# EAGLE design TMR1_v2 (EAGLE 9.2.2)
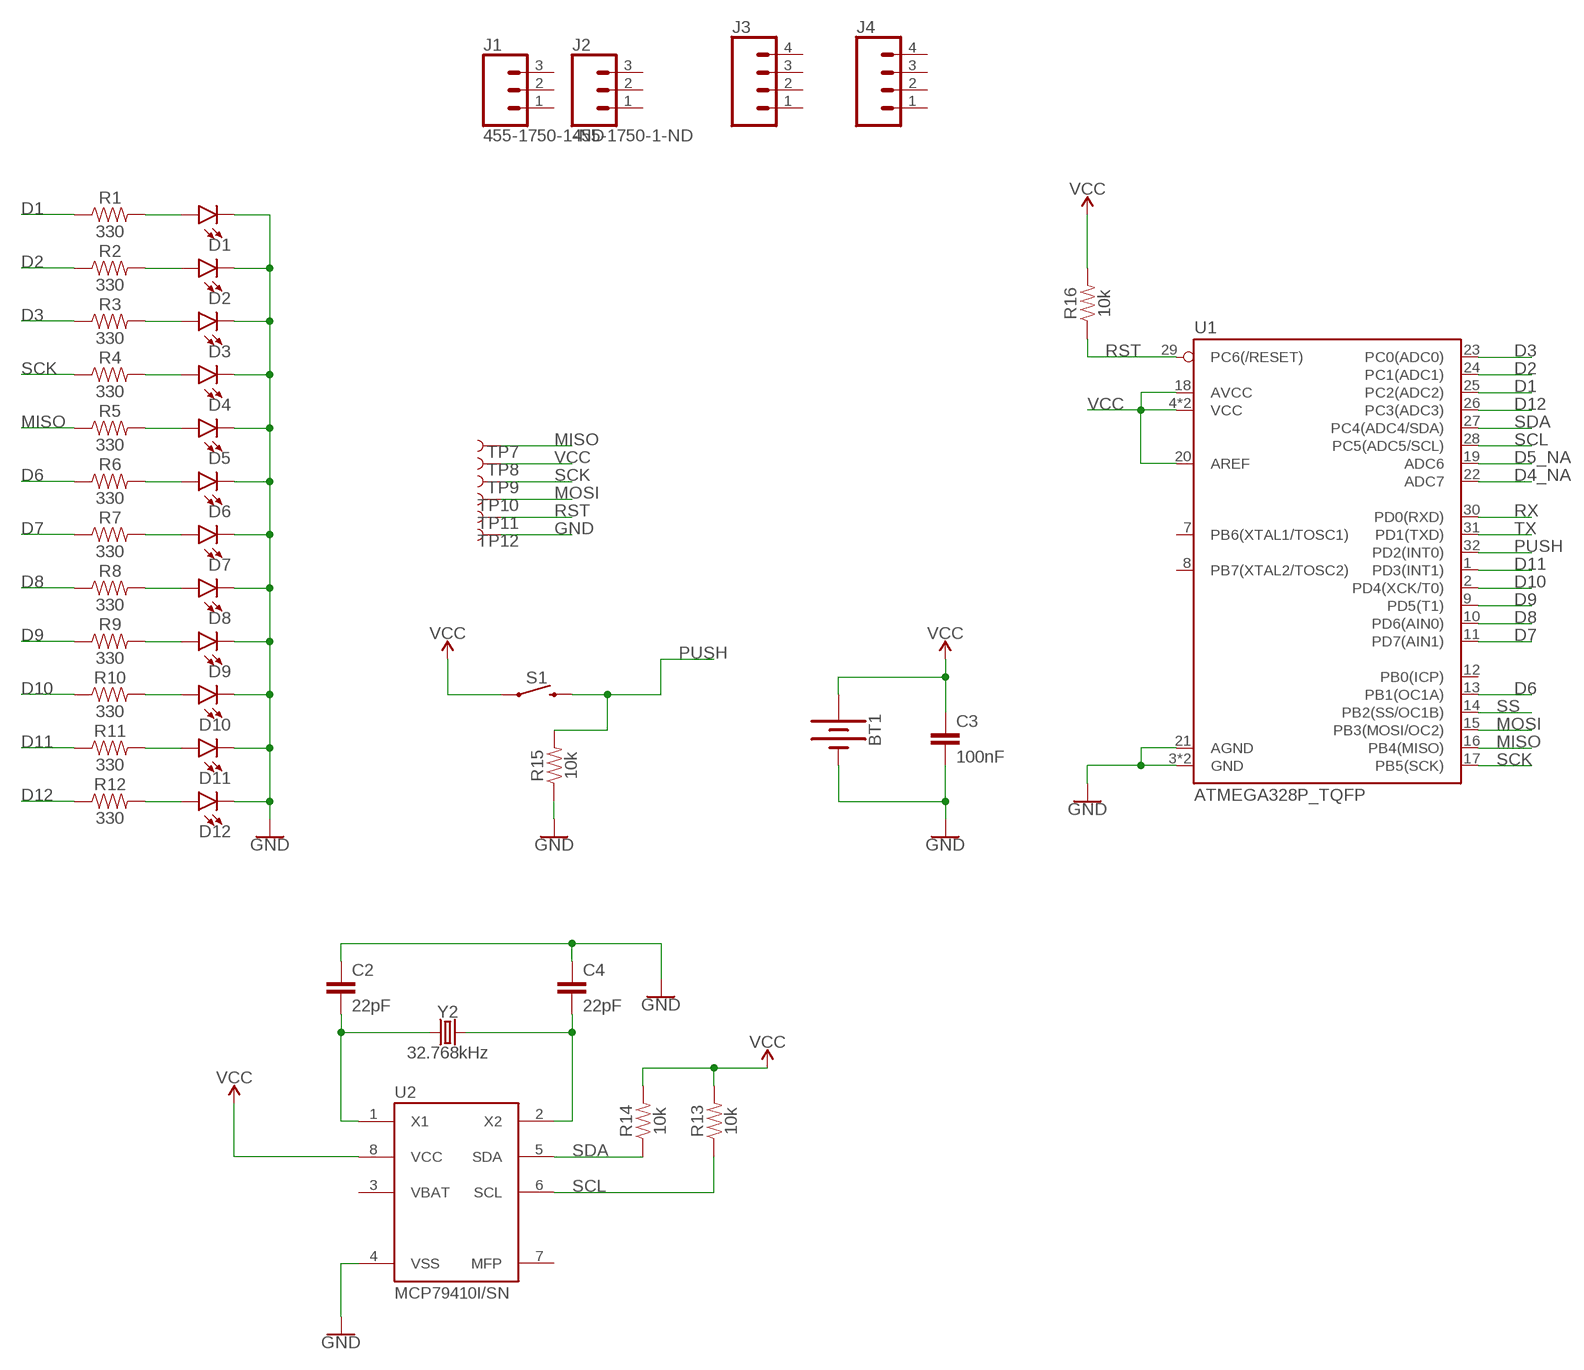
[diagram p0: schematic, sheet 1]

## Parts
BT1  BATTERY-20MM_SMD_4LEGS  [BATTCON_20MM_4LEGS]
C2  22pF  22PF-0603-50V-5%  [0603]
C3  100nF  22PF-0603-50V-5%  [0603]
C4  22pF  22PF-0603-50V-5%  [0603]
D1  LED0603  [LED-0603]
D2  LED0603  [LED-0603]
D3  LED0603  [LED-0603]
D4  LED0603  [LED-0603]
D5  LED0603  [LED-0603]
D6  LED0603  [LED-0603]
D7  LED0603  [LED-0603]
D8  LED0603  [LED-0603]
D9  LED0603  [LED-0603]
D10  LED0603  [LED-0603]
D11  LED0603  [LED-0603]
D12  LED0603  [LED-0603]
J1  455-1750-1-ND  CONN_03  [1X03]
J2  455-1750-1-ND  CONN_03  [1X03]
J3  CONN_04  [1X04]
J4  CONN_04  [1X04]
R1  330  330OHM-0603-1/10W-1%  [0603]
R2  330  330OHM-0603-1/10W-1%  [0603]
R3  330  330OHM-0603-1/10W-1%  [0603]
R4  330  330OHM-0603-1/10W-1%  [0603]
R5  330  330OHM-0603-1/10W-1%  [0603]
R6  330  330OHM-0603-1/10W-1%  [0603]
R7  330  330OHM-0603-1/10W-1%  [0603]
R8  330  330OHM-0603-1/10W-1%  [0603]
R9  330  330OHM-0603-1/10W-1%  [0603]
R10  330  330OHM-0603-1/10W-1%  [0603]
R11  330  330OHM-0603-1/10W-1%  [0603]
R12  330  330OHM-0603-1/10W-1%  [0603]
R13  10k  10KOHM-0603-1/10W-1%  [0603]
R14  10k  10KOHM-0603-1/10W-1%  [0603]
R15  10k  10KOHM-0603-1/10W-1%  [0603]
R16  10k  10KOHM-0603-1/10W-1%  [0603]
S1  MOMENTARY-SWITCH-SPST-SMD-5.2MM  [TACTILE_SWITCH_SMD_5.2MM]
TP7  TEST-POINT3X4  [PAD.03X.04]
TP8  TEST-POINT3X4  [PAD.03X.04]
TP9  TEST-POINT3X4  [PAD.03X.04]
TP10  TEST-POINT3X4  [PAD.03X.04]
TP11  TEST-POINT3X4  [PAD.03X.04]
TP12  TEST-POINT3X4  [PAD.03X.04]
U1  ATMEGA328P_TQFP  [TQFP32-08]
U2  MCP79410I/SN  [SO8]
Y2  32.768kHz  CRYSTAL-32.768KHZPTH-2X6  [CRYSTAL-PTH-2X6-CYL]

## Nets
D1: R1.1 U1.25(PC2(ADC2))
D2: R2.1 U1.24(PC1(ADC1))
D3: R3.1 U1.23(PC0(ADC0))
D4_NA: U1.22(ADC7)
D5_NA: U1.19(ADC6)
D6: R6.1 U1.13(PB1(OC1A))
D7: R7.1 U1.11(PD7(AIN1))
D8: R8.1 U1.10(PD6(AIN0))
D9: R9.1 U1.9(PD5(T1))
D10: R10.1 U1.2(PD4(XCK/T0))
D11: R11.1 U1.1(PD3(INT1))
D12: R12.1 U1.26(PC3(ADC3))
GND: BT1.NEGATIVE(-) C2.1 C3.2 C4.1 D1.C D2.C D3.C D4.C D5.C D6.C D7.C D8.C D9.C D10.C D11.C D12.C R15.1 TP12.P$1 U1.3(GND) U1.5(GND) U1.21(AGND) U2.4(VSS)
MISO: R5.1 TP7.P$1 U1.16(PB4(MISO))
MOSI: TP10.P$1 U1.15(PB3(MOSI/OC2))
N$1: D8.A R8.2
N$2: D7.A R7.2
N$3: D6.A R6.2
N$4: D5.A R5.2
N$5: D4.A R4.2
N$6: D3.A R3.2
N$7: D2.A R2.2
N$8: D1.A R1.2
N$9: C2.2 U2.1(X1) Y2.1
N$10: C4.2 U2.2(X2) Y2.2
N$18: D9.A R9.2
N$20: D10.A R10.2
N$22: D11.A R11.2
N$24: D12.A R12.2
PUSH: R15.2 S1.3 U1.32(PD2(INT0))
RST: R16.1 TP11.P$1 U1.29(PC6(/RESET))
RX: U1.30(PD0(RXD))
SCK: R4.1 TP9.P$1 U1.17(PB5(SCK))
SCL: R13.1 U1.28(PC5(ADC5/SCL)) U2.6(SCL)
SDA: R14.1 U1.27(PC4(ADC4/SDA)) U2.5(SDA)
SS: U1.14(PB2(SS/OC1B))
TX: U1.31(PD1(TXD))
VCC: BT1.POSITIVE@1(+) BT1.POSITIVE@2(+) BT1.POSITIVE@3(+) BT1.POSITIVE@4(+) C3.1 R13.2 R14.2 R16.2 S1.1 TP8.P$1 U1.4(VCC) U1.6(VCC) U1.18(AVCC) U1.20(AREF) U2.8(VCC)
Unconnected: J1.1 J1.2 J1.3 J2.1 J2.2 J2.3 J3.1 J3.2 J3.3 J3.4 J4.1 J4.2 J4.3 J4.4 U1.7(PB6(XTAL1/TOSC1)) U1.8(PB7(XTAL2/TOSC2)) U1.12(PB0(ICP)) U2.7(MFP)

## Power pins joined to a net without a drawn wire
VBAT: U2.3(VBAT)

## Library data of the parts
BT1 = SparkFun-Batteries:BATTERY: Battery - Single Cell A variety of battery chemistries, sizes, and footprints. Device List: 20MM_PTH - Coin Cell Battery Holder - 20mm (PTH) <https://www.sparkfun.com/products/783> 20MM_PTH_KIT- Coin Cell battery Holder - 20 mm (PTH) <http://www.sparkfun.com/products/783>kit version with special mask 6.8MM_PTH - Coin Cell Battery Holder - 6.8MM(SMD) <https://www.digikey.com/product-detail/en/seiko-instruments/MS621FE-FL11E/728-1057-ND/1889208?WT.srch=1&gclid=CNOQ5a6LzdQCFZS2wAodXCkE0g> 12MM_SMD - Coin Cell Battery Holder - 12mm (SMD) <https://www.sparkfun.com/products/10592> 12MM_PTH - Coin Cell Battery Holder - 12mm (PTH) <https://www.sparkfun.com/products/7948> 20MM_SMD - 20mm Coin Cell Battery Holder (SMD) (2 legs) Used on the Big Time Watch Kit <https://www.sparkfun.com/products/11734> 20MM_SMD_4LEGS - Coin Cell Battery Holder - 20mm (SMD) <https://www.sparkfun.com/products/11892> 20MM_SMD_4LEGS_OVERPASTE - Coin Cell Battery Holder - 20mm (SMD) <https://www.sparkfun.com/products/11892> (Over-paste on the legs) 24.5MM_PTH - Coin Cell Battery Holder - 24.5mm (PTH) <https://www.sparkfun.com/products/8863> 9V - 9V Battery Holder - PC Mount Used on the SparkFun SparkPunk Sound Kit <https://www.sparkfun.com/products/11177> and SparkFun SparkPunk Sequencer Kit <https://www.sparkfun.com/products/12707> 18650 - Battery Holder - 18650 (PTH) <https://www.sparkfun.com/products/13113> AA - Battery Holder - 1xAA (PTH) <https://www.sparkfun.com/products/7949> AAA - Battery Holder - 1xAAA (PTH) <https://www.sparkfun.com/products/12718> AA_KIT - Battery Holder - 1xAA (PTH) <https://www.sparkfun.com/products/7949> Special kit package - pads only have exposed copper on one side of the board. AAA_KIT - Battery Holder - 1xAAA (PTH) <https://www.sparkfun.com/products/12718> Special kit package - pads only have exposed copper on one side of the board.; PROD_ID: BATT-10373; SF_SKU: PRT-11892
C2 C4 = SparkFun-Capacitors:22PF: 22pF ceramic capacitors A capacitor is a passive two-terminal electrical component used to store electrical energy temporarily in an electric field.; PROD_ID: CAP-07876
C3 = SparkFun-Capacitors:22PF: 22pF ceramic capacitors A capacitor is a passive two-terminal electrical component used to store electrical energy temporarily in an electric field.; PROD_ID: CAP-07876; VALUE: 22pF
D1-D12 = SparkFun-LED:LED: LED (Generic) Standard schematic elements and footprints for 5mm, 3mm, 1206, and 0603 sized LEDs. Generic LEDs with no color specified.
J1 J2 = SparkFun-Connectors:CONN_03: Multi connection point. Often used as Generic Header-pin footprint for 0.1 inch spaced/style header connections On any of the 0.1 inch spaced packages, you can populate with these: Break Away Headers - Straight <https://www.sparkfun.com/products/116> (PRT-00116) Break Away Male Headers - Right Angle <https://www.sparkfun.com/products/553> (PRT-00553) Female Headers <https://www.sparkfun.com/products/115> (PRT-00115) Break Away Headers - Machine Pin <https://www.sparkfun.com/products/117> (PRT-00117) Break Away Female Headers - Swiss Machine Pin <https://www.sparkfun.com/products/743> (PRT-00743) Stackable Header - 3 Pin (Female, 0.1") <https://www.sparkfun.com/products/13875> (PRT-13875) For SCREWTERMINALS and SPRING TERMINALS visit here: Screw Terimnals on SparkFun.com <https://www.sparkfun.com/search/results?term=Screw+Terminals> (5mm/3.5mm/2.54mm spacing) This device is also useful as a general connection point to wire up your design to another part of your project. Our various solder wires solder well into these plated through hole pads. Hook-Up Wire - Assortment (Stranded, 22 AWG) <https://www.sparkfun.com/products/11375> (PRT-11375) Hook-Up Wire - Assortment (Solid Core, 22 AWG) <https://www.sparkfun.com/products/11367> (PRT-11367) View the entire wire category on our website here <https://www.sparkfun.com/categories/141> Special notes: Molex polarized connector foot print use with SKU : PRT-08232 with associated crimp pins and housings.; PROD_ID: XXX-00000
J3 J4 = SparkFun-Connectors:CONN_04: Multi connection point. Often used as Generic Header-pin footprint for 0.1 inch spaced/style header connections On any of the 0.1 inch spaced packages, you can populate with these: Break Away Headers - Straight <https://www.sparkfun.com/products/116> (PRT-00116) Break Away Male Headers - Right Angle <https://www.sparkfun.com/products/553> (PRT-00553) Female Headers <https://www.sparkfun.com/products/115> (PRT-00115) Break Away Headers - Machine Pin <https://www.sparkfun.com/products/117> (PRT-00117) Break Away Female Headers - Swiss Machine Pin <https://www.sparkfun.com/products/743> (PRT-00743) For SCREWTERMINALS and SPRING TERMINALS visit here: Screw Terimnals on SparkFun.com <https://www.sparkfun.com/search/results?term=Screw+Terminals> (5mm/3.5mm/2.54mm spacing) This device is also useful as a general connection point to wire up your design to another part of your project. Our various solder wires solder well into these plated through hole pads. Hook-Up Wire - Assortment (Stranded, 22 AWG) <https://www.sparkfun.com/products/11375> (PRT-11375) Hook-Up Wire - Assortment (Solid Core, 22 AWG) <https://www.sparkfun.com/products/11367> (PRT-11367) View the entire wire category on our website here <https://www.sparkfun.com/categories/141> Special notes: Molex polarized connector foot print use with SKU : PRT-08231 with associated crimp pins and housings. 1MM SMD Version SKU: PRT-10208; PROD_ID: CONN-09696
R1-R12 = SparkFun-Resistors:330OHM: 330Ω resistor A resistor is a passive two-terminal electrical component that implements electrical resistance as a circuit element. Resistors act to reduce current flow, and, at the same time, act to lower voltage levels within circuits. - Wikipedia; PROD_ID: RES-00818
R13-R16 = SparkFun-Resistors:10KOHM: 10kΩ resistor A resistor is a passive two-terminal electrical component that implements electrical resistance as a circuit element. Resistors act to reduce current flow, and, at the same time, act to lower voltage levels within circuits. - Wikipedia; PROD_ID: RES-00824
S1 = SparkFun-Switches:MOMENTARY-SWITCH-SPST: Momentary Switch (Pushbutton) - SPST Normally-open (NO) SPST momentary switches (buttons, pushbuttons). Variants PTH-12MM - 12mm square, through-hole Momentary Pushbutton Switch - 12mm Square <https://www.sparkfun.com/products/9190> (COM-09190) PTH-6.0MM, PTH-6.0MM-KIT - 6.0mm square, through-hole Mini Pushbutton Switch <https://www.sparkfun.com/products/97> (COM-00097) KIT package intended for soldering kit's - only one side of pads' copper is exposed. PTH-RIGHT-ANGLE-KIT - Right-angle, through-hole Right Angle Tactile Button <https://www.sparkfun.com/products/10791> - Used on SparkFun BigTime Watch Kit <https://www.sparkfun.com/products/11734> SMD-12MM - 12mm square, surface-mount Tactile Button - SMD (12mm) <https://www.sparkfun.com/products/12993> (COM-12993) Used on SparkFun PicoBoard <https://www.sparkfun.com/products/11888> SMD-4.5MM - 4.5mm Square Trackball Switch Used on SparkFun Blackberry Trackballer Breakout <https://www.sparkfun.com/products/13169> SMD-4.6MMX2.8MM - 4.60mm x 2.80mm, surface mount Used on SparkFun SAMD21 Mini Breakout <https://www.sparkfun.com/products/13664> SMD-5.2MM, SMD-5.2-REDUNDANT - 5.2mm square, surface-mount Mini Pushbutton Switch - SMD <https://www.sparkfun.com/products/8720> (COM-08720) Used on Arduino Pro Mini <https://www.sparkfun.com/products/11114> REDUNDANT package connects both switch circuits together SMD-6.0X3.5MM - 6.0 x 3.5mm, surface mount Momentary Reset Switch SMD <https://www.sparkfun.com/products/8229> (COM-08229) SMD-6.2MM-TALL - 6.2mm square, surface mount Tactile Button - SMD (6mm) <https://www.sparkfun.com/products/12992> Used on SparkFun Digital Sandbox <https://www.sparkfun.com/products/12651> SMD-RIGHT-ANGLE - Right-angle, surface mount Used on SparkFun Block for Intel® Edison - Arduino <https://www.sparkfun.com/products/13036>; PROD_ID: SWCH-08247; SF_SKU: COM-08720
TP7-TP12 = SparkFun-Connectors:TEST-POINT: SparkFun Test Points Bare copper test points for troubleshooting or In-Circuit-Testing. These are used by our Production team for verifying production board runs using pogo-pins on test beds. SparkFun Products: SparkFun LSM9DS1 Breakout <https://www.sparkfun.com/products/13284> SparkFun PSOC <https://www.sparkfun.com/products/13714> SparkFun Load Cell Amplifier <https://www.sparkfun.com/products/13879>
U1 = SparkFun-IC-Microcontroller:ATMEGA328P_TQFP: Popular 328P in QFP Storefront component: ATmega328 - TQFP <https://www.sparkfun.com/products/13448> (COM-13448) Datasheet <http://www.sparkfun.com/datasheets/Components/SMD/ATMega328.pdf> SparkFun Products SparkFun RedBoard - Programmed with Arduino <https://www.sparkfun.com/products/12757> (DEV-12757) Arduino Pro Mini 328 - 5V/16MHz <https://www.sparkfun.com/products/11113> (DEV-11113) Arduino Pro Mini 328 - 3.3V/8MHz <https://www.sparkfun.com/products/11114> (DEV-11114) SparkFun OpenLog <https://www.sparkfun.com/products/13712> (DEV-13712) SparkFun MicroView - OLED Arduino Module <https://www.sparkfun.com/products/12923> (DEV-12923) SparkFun Digital Sandbox <https://www.sparkfun.com/products/12651> (DEV-12651) SparkFun PicoBoard <https://www.sparkfun.com/products/11888> (WIG-11888) Arduino Fio <https://www.sparkfun.com/products/10116> (DEV-10116) LilyPad Arduino 328 Main Board <https://www.sparkfun.com/products/13342> (DEV-13342) SparkFun RedStick <https://www.sparkfun.com/products/13741> (DEV-13741) LilyPad MP3 <https://www.sparkfun.com/products/11013> (DEV-11013) LilyPad Arduino SimpleSnap <https://www.sparkfun.com/products/10941> (DEV-10941) SparkFun Stepoko <https://www.sparkfun.com/products/13899> (ROB-13899) SparkFun Geiger Counter <https://www.sparkfun.com/products/11345> (SEN-11345) SparkFun EL Sequencer <https://www.sparkfun.com/products/12781> (COM-12781) Arduino Pro 328 - 5V/16MHz <https://www.sparkfun.com/products/10915> (DEV-10915) CryptoCape <https://www.sparkfun.com/products/12773> (DEV-12773) SparkFun IR Thermometer Evaluation Board - MLX90614 <https://www.sparkfun.com/products/10740> (SEN-10740) SparkFun RedBot Mainboard <https://www.sparkfun.com/products/12097> (ROB-12097) Arduino Pro 328 - 3.3V/8MHz <https://www.sparkfun.com/products/10914> (DEV-10914) SparkFun Block for Intel® Edison - Arduino <https://www.sparkfun.com/products/13036> (DEV-13036) SparkFun Simon Says - Surface Mount Soldering Kit <https://www.sparkfun.com/products/10935> (KIT-10935) SparkFun 7-Segment Serial Display - Red <https://www.sparkfun.com/products/11441> (COM-11441) SparkFun 7-Segment Serial Display - White <https://www.sparkfun.com/products/11629> (COM-11629) SparkFun 7-Segment Serial Display - Yellow <https://www.sparkfun.com/products/11443> (COM-11443) SparkFun 7-Segment Serial Display - Kelly Green <https://www.sparkfun.com/products/11440> (COM-11440) SparkFun 7-Segment Serial Display - Blue <https://www.sparkfun.com/products/11442> (COM-11442) SparkFun OpenSegment Serial Display - 20mm (Blue) <https://www.sparkfun.com/products/11647> (COM-11647) SparkFun OpenSegment Serial Display - 20mm (Green) <https://www.sparkfun.com/products/11646> (COM-11646) SparkFun OpenSegment Serial Display - 20mm (White) <https://www.sparkfun.com/products/11648> (COM-11648) SparkFun OpenSegment Serial Display - 20mm (Red) <https://www.sparkfun.com/products/11644> (COM-11644) SparkFun OpenSegment Serial Display - 20mm (Yellow) <https://www.sparkfun.com/products/11645> (COM-11645) SparkFun OpenSegment Shield <https://www.sparkfun.com/products/13190> (DEV-13190); PROD_ID: IC-09069
U2 = _hhn_MCP7941X:MCP7941*?: Microchip MCP79410 / MCP79411 / MCP79412 I²C Real Time CLock/Calendar with Unique ID Rev. 5.0.0 as of 2013-10-23, for EAGLE 5+ Changelog 5.0.0 (initial) MCP79410XI/YY X: Unique ID 0: blank 1: EUI-48 2: EUI-96 I: Temperature Range (Industrial) /YY: Package /MS: MSOP8_.65 (8-Lead Micro Small Outline Package, 0.65mm pitch) /SN: SOIC8 (8-Lead Small Outline [Narrow], 3.9mm body) /ST: TSSOP8 (8-Lead Thin Schrink Small Outline, 4.4mm body) Source: http://www.microchip.com Author: Dipl.-Ing. FH Rainer Bayer Heilbronn University HHN http://www.hs-heilbronn.de/rainer.bayer · rainer.bayer@hs-heilbronn.de Engineering office ing-rb: http://www.ing-rb.de/ · eagle@ing-rb.de Lectureship dozent-rb: http://www.dozent-rb.de/ · eagle@dozent-rb.de
Y2 = SparkFun-Clocks:CRYSTAL-32.768KHZ: 32.768kHz Crystal Frequency: 32.768kHz Frequency Stability: ±20ppm Load Capacitance: 12.5pF (PTH-2X6 & SMD-3.2X1.5), 6pF (SMD-2X6) SparkFun Products: SparkFun BigTime Watch Kit <https://www.sparkfun.com/products/11734> SparkFun nRF52832 Breakout <https://www.sparkfun.com/products/13990> SparkFun Real Time Clock Module <https://www.sparkfun.com/products/12708>; PROD_ID: XTAL-10112

## Board
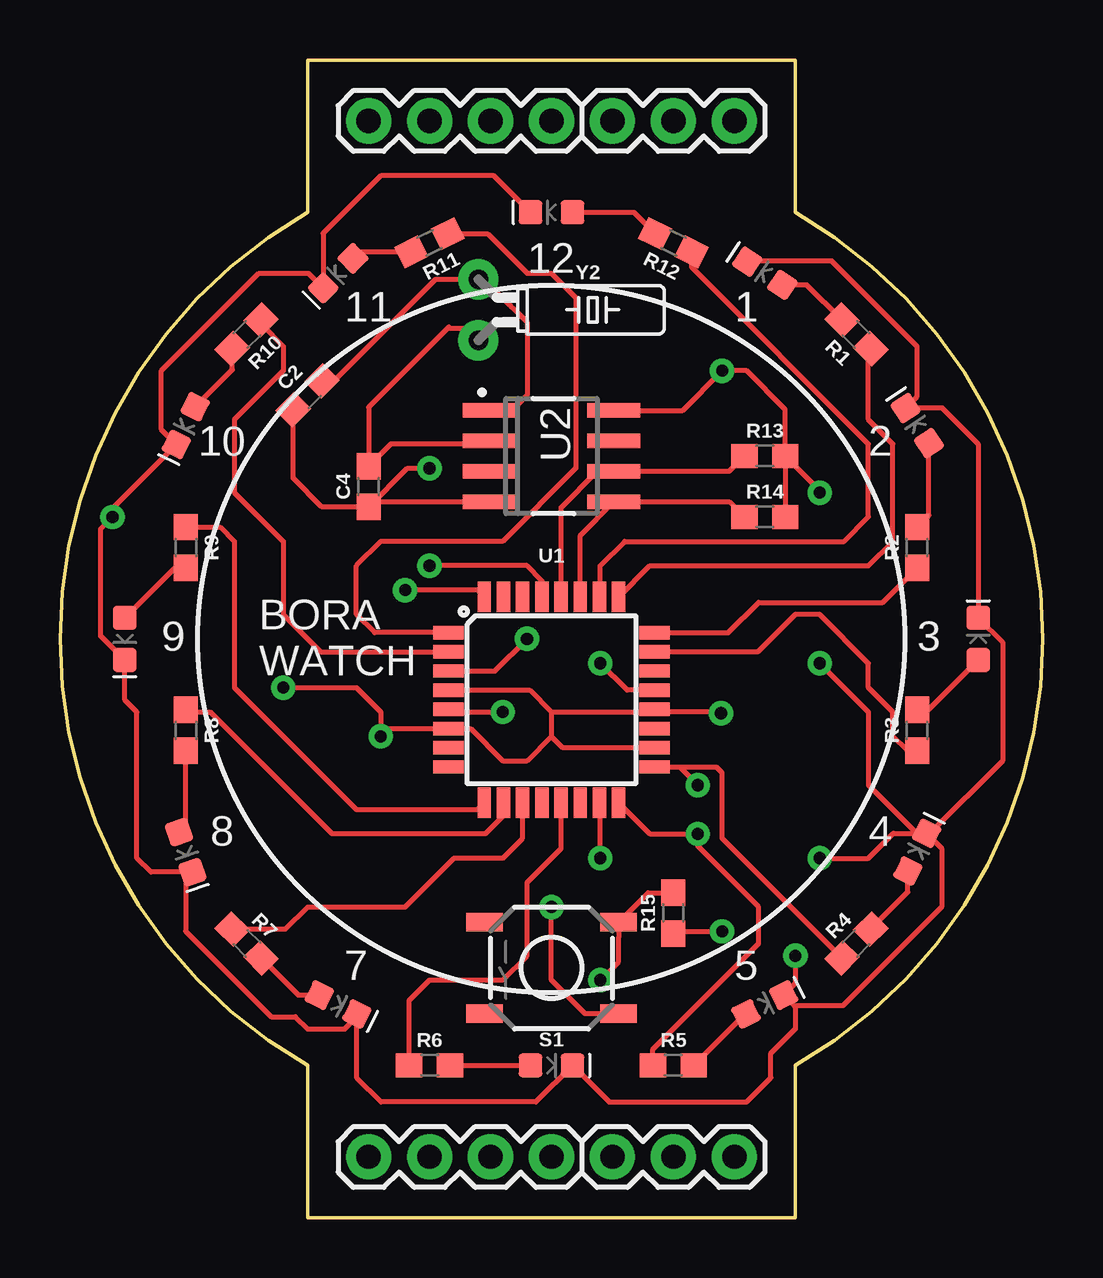
[diagram p1: board, top side]
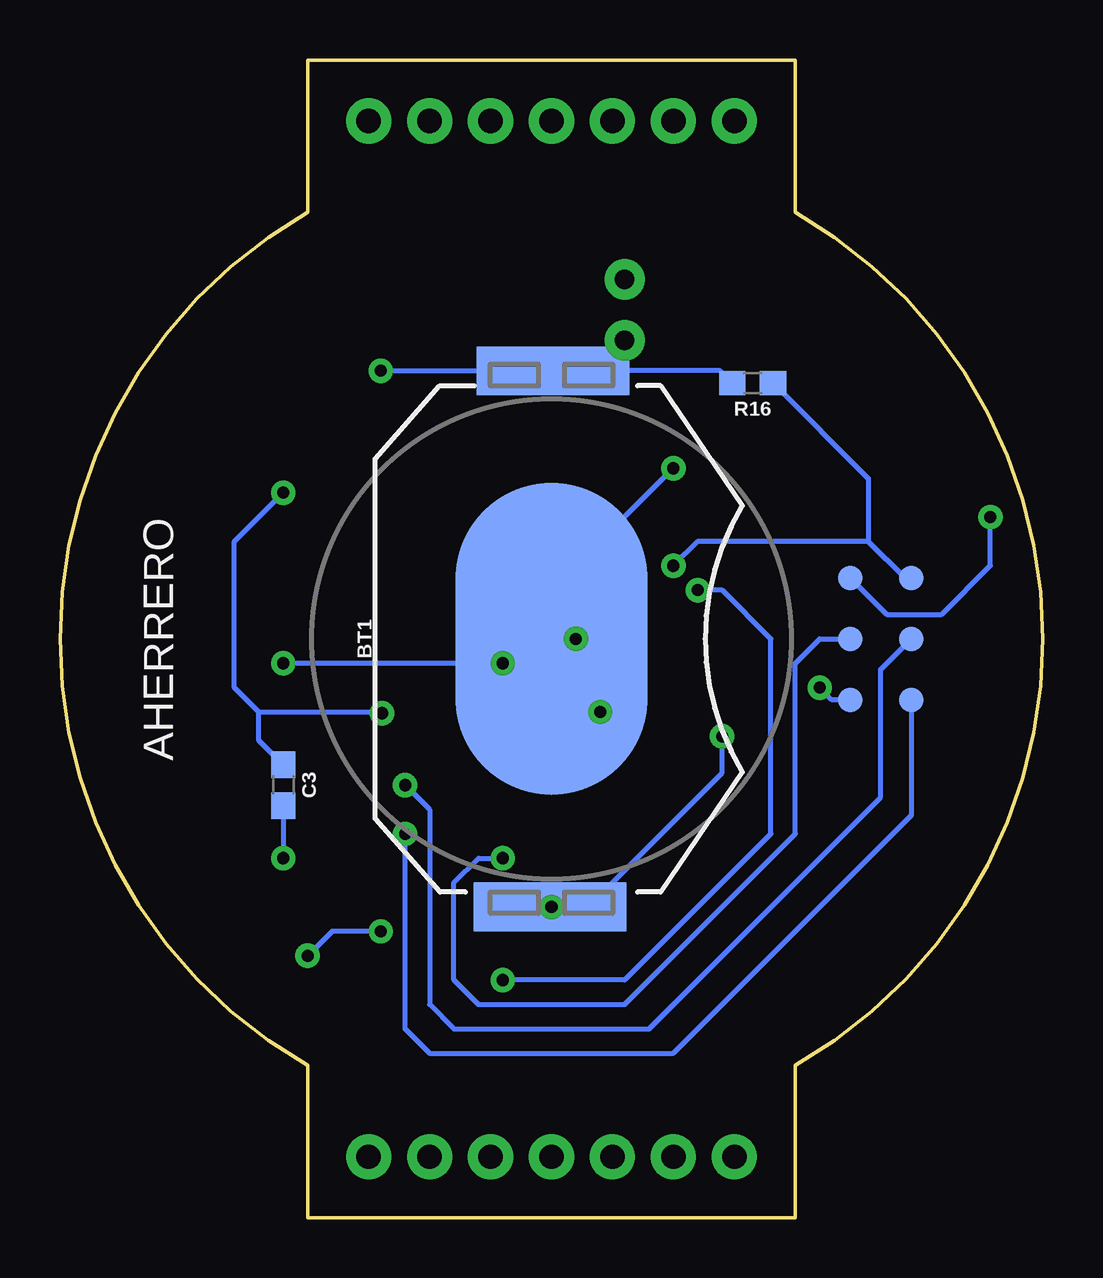
[diagram p2: board, bottom side, seen from below]

Size 40.96 x 48.26 mm. Coordinates in mm from the lower left corner, seen from the top.
Outline: 30.64,41.91 arc-121 30.64,6.35 30.64,0 10.32,0 10.32,6.35 arc-121 10.32,41.91 10.32,48.26 30.64,48.26 30.64,41.91
Copper layers (1*16): Top 0.035mm / dielectric 1.5mm / Bottom 0.035mm
Design rules "SparkFun": minimum track width 8mil, minimum drill 20mil, track to track 8mil, track to pad 8mil, pad to pad 8mil, via to via 8mil, smd to smd 8mil, copper to edge 8mil, drill to drill 8mil, minimum pad ring 12mil, minimum via ring 10mil, stop-mask expansion 4mil, vias tented up to drill 20mil, thermal gap 10mil

### Footprints (pad centres in the part's own frame; a part is rotated, then mirrored left to right if it is on the bottom)
BATTCON_20MM_4LEGS = smd 13 x 8: NEGATIVE 0,0 | smd 2.032 x 3.175: POSITIVE@1 -11.176,1.651; POSITIVE@2 -11.176,-1.524; POSITIVE@3 11.176,1.524; POSITIVE@4 11.176,-1.651
0603 = smd 1.1 x 1: 1 -0.85,0; 2 0.85,0
LED-0603 = smd 1 x 1: A -0.877,0; C 0.877,0
1X03 = drill 1.016 pad 1.88: 1 0,0; 2 2.54,0; 3 5.08,0
1X04 = drill 1.016 pad 1.88: 1 0,0; 2 2.54,0; 3 5.08,0; 4 7.62,0
TACTILE_SWITCH_SMD_5.2MM = smd 1.524 x 0.762: 1 -2.794,1.905; 2 2.794,1.905; 3 -2.794,-1.905; 4 2.794,-1.905
PAD.03X.04 = smd 1.016 x 1.016: P$1 0,0
TQFP32-08 = smd 1.27 x 0.559: 1 -4.293,2.8; 2 -4.293,2; 3 -4.293,1.2; 4 -4.293,0.4; 5 -4.293,-0.4; 6 -4.293,-1.2; 7 -4.293,-2; 8 -4.293,-2.8; 17 4.293,-2.8; 18 4.293,-2; 19 4.293,-1.2; 20 4.293,-0.4; 21 4.293,0.4; 22 4.293,1.2; 23 4.293,2; 24 4.293,2.8 | smd 0.559 x 1.27: 9 -2.8,-4.293; 10 -2,-4.293; 11 -1.2,-4.293; 12 -0.4,-4.293; 13 0.4,-4.293; 14 1.2,-4.293; 15 2,-4.293; 16 2.8,-4.293; 25 2.8,4.293; 26 2,4.293; 27 1.2,4.293; 28 0.4,4.293; 29 -0.4,4.293; 30 -1.2,4.293; 31 -2,4.293; 32 -2.8,4.293
SO8 = smd 0.6 x 2.2: 1 -1.905,-2.6; 2 -0.635,-2.6; 3 0.635,-2.6; 4 1.905,-2.6; 5 1.905,2.6; 6 0.635,2.6; 7 -0.635,2.6; 8 -1.905,2.6
CRYSTAL-PTH-2X6-CYL = drill 0.813 pad 1.676: 1 -1.27,0; 2 1.27,0

### Placement (x,y rotation side)
BT1  20.48,24.13 90 bottom
C2  10.32,34.29 45 top
C3  31.65,18.03 270 bottom
C4  12.86,30.48 90 top
D1  29.37,39.37 146.3 top
D2  35.72,33.02 123.7 top
D3  38.26,24.13 90 top
D4  35.72,15.24 63.5 top
D5  29.37,8.89 26.5 top
D6  20.48,6.35 0 top
D7  11.59,8.89 333.5 top
D8  5.24,15.24 288.5 top
D9  2.7,24.13 270 top
D10  5.24,33.02 243.5 top
D11  11.59,39.37 225 top
D12  20.48,41.91 180 top
J1  23.02,45.72 0 top
J2  23.02,2.54 0 top
J3  12.86,2.54 0 top
J4  12.86,45.72 0 top
R1  33.18,36.83 135 top
R2  35.72,27.94 90 top
R3  35.72,20.32 90 top
R4  33.18,11.43 45 top
R5  25.56,6.35 0 top
R6  15.4,6.35 0 top
R7  7.78,11.43 315 top
R8  5.24,20.32 270 top
R9  5.24,27.94 270 top
R10  7.78,36.83 225 top
R11  15.4,40.64 206.5 top
R12  25.56,40.64 153.5 top
R13  29.37,31.75 0 top
R14  29.37,29.21 0 top
R15  25.56,12.7 90 top
R16  12.1,34.8 180 bottom
S1  20.48,10.41 180 top
TP7  5.49,21.59 0 bottom
TP8  8.03,21.59 0 bottom
TP9  5.49,24.13 0 bottom
TP10  8.03,24.13 0 bottom
TP11  5.49,26.67 0 bottom
TP12  8.03,26.67 0 bottom
U1  20.48,21.59 0 top
U2  20.48,31.75 270 top
Y2  17.43,37.85 270 top

### Tracks (layer width: path | path; a pad name or v marks a point on that pad's centre or on a via)
D1
  Top 0.203: U1.25 24.57,27.18 33.69,27.18 34.7,28.19 34.7,32.26 33.69,33.27 33.69,36.14 R1.1
D2
  Top 0.203: U1.24 27.85,24.39 29.11,25.65 34.28,25.65 R2.1
D3
  Top 0.203: R3.1 35.3,19.47 34.7,20.07 34.7,21.08 33.69,22.1 33.69,23.11 31.65,25.15 30.64,25.15 29.08,23.59 U1.23
D6
  Top 0.203: R6.1 14.55,9.06 15.4,9.91 18.45,9.91 19.46,10.92 19.46,13.97 20.88,15.39 U1.13
D7
  Top 0.203: R7.1 9.4,12.03 10.32,12.95 14.38,12.95 16.41,14.99 18.45,14.99 19.28,15.82 U1.11
D8
  Top 0.203: R8.1 5.33,21.08 6.25,21.08 11.33,16 17.73,16 18.48,16.75 U1.10
D9
  Top 0.203: R9.1 6.67,28.79 7.27,28.19 7.27,22.1 12.35,17.02 17.4,17.02 U1.9
D10
  Top 0.203: R10.1 8.38,37.24 9.3,36.32 9.3,35.31 7.27,33.27 7.27,30.23 9.3,28.19 9.3,25.15 10.86,23.59 U1.2
D11
  Top 0.203: R11.1 17.81,41.02 19.46,39.37 20.48,39.37 21.49,38.35 21.49,31.24 18.45,28.19 13.37,28.19 12.35,27.18 12.35,25.15 13.11,24.39 U1.1
D12
  Top 0.203: U1.26 22.51,25.91 22.51,27.18 23.53,28.19 32.67,28.19 33.69,29.21 33.69,32.26 26.32,39.62 R12.1
GND  (via drill 0.51)
  Top 0.203: C4.1 10.91,29.63 9.72,30.83 C2.1 | C4.1 13.07,29.84 U2.4 | 12.37,8.38 12.37,5.82 13.37,4.83 19.83,4.83 D6.C 22.88,4.83 28.61,4.83 29.62,5.84 29.62,6.86 30.64,7.87 30.64,8.8 30.59,8.84 | 12.37,8.38 D7.C | 30.59,8.84 D5.C 30.64,9.77 v30.64,10.92 | 30.59,8.84 32.62,8.84 36.73,12.95 36.73,15.4 D4.C | D4.C 36.25,16.03 39.27,19.05 39.27,23.99 D3.C 38.26,32.26 36.77,33.75 D2.C 35.72,34.24 35.72,36.32 32.16,39.88 28.66,39.88 D1.C | D12.C 18.08,43.43 13.37,43.43 10.97,41.04 D11.C 10.35,39.37 8.29,39.37 4.22,35.31 4.22,32.86 D10.C 2.19,29.58 v2.19,29.21 1.68,28.7 1.68,24.27 D9.C 2.7,21.59 3.21,21.08 3.21,14.99 3.78,14.41 D8.C 5.24,14.13 5.24,11.94 8.68,8.5 8.79,8.38 9.81,8.38 10.32,7.87 11.87,7.87 12.37,8.38 | U1.5 16.29,21.08 v18.45,21.08 | U1.21 23.63,21.99 v22.51,23.11 | U1.3 18.12,22.79 v19.46,24.13 | v31.65,23.11 33.69,21.08 33.69,18.03 35.7,16.03 D4.C | C4.1 14.47,31.24 v15.4,31.24 | v31.65,14.99 33.69,14.99 34.73,16.03 D4.C | R15.1 25.65,11.94 v27.59,11.94
  Bottom 0.203: v18.45,21.08 20.48,23.11 BT1.NEGATIVE | v19.46,24.13 BT1.NEGATIVE | BT1.NEGATIVE 21.49,23.11 v22.51,23.11 v31.65,23.11 | v15.4,31.24 20.48,26.16 BT1.NEGATIVE | C3.2 v31.65,14.99 | v27.59,11.94 29.62,11.94 v30.64,10.92 | TP12.P$1 6.51,25.15 4.22,25.15 2.19,27.18 v2.19,29.21
MISO  (via drill 0.51)
  Top 0.203: U1.16 24.57,16 v26.57,16 26.57,15.49 29.11,12.95 29.11,11.43 24.71,7.02 R5.1
  Bottom 0.203: TP7.P$1 5.49,16.76 15.4,6.86 25.56,6.86 26.57,7.87 v26.57,16
MOSI  (via drill 0.51)
  Top 0.203: v22.51,14.99 22.51,17.27 U1.15
  Bottom 0.203: TP10.P$1 9.3,24.13 10.32,23.11 10.32,16 17.43,8.89 23.53,8.89 24.54,9.91 24.54,13.97 23.53,14.99 v22.51,14.99
N$1
  Top 0.203: D8.A 5.24,16.35 R8.2
N$2
  Top 0.203: R7.2 9.93,9.28 D7.A
N$3
  Top 0.203: R6.2 D6.A
N$4
  Top 0.203: R5.2 28.56,8.5 D5.A
N$5
  Top 0.203: R4.2 35.33,13.58 D4.A
N$6
  Top 0.203: R3.2 36.18,21.17 D3.A
N$7
  Top 0.203: R2.2 36.21,29.28 D2.A
N$8
  Top 0.203: R1.2 31.13,38.88 D1.A
N$9
  Top 0.203: U2.1 18.83,33.65 19.46,34.29 19.46,37.34 18.95,37.85 18.77,38.03 17.68,39.12 Y2.1 15.65,39.12 11.43,34.89 C2.2
N$10
  Top 0.203: 16.21,37.13 16.16,37.08 | 16.16,37.08 12.86,33.78 C4.2 13.79,32.26 17.75,32.26 U2.2 | 16.16,37.08 16.92,37.08 Y2.2
N$18
  Top 0.203: D9.A 4.78,27.09 R9.2
N$20
  Top 0.203: D10.A 7.18,35.35 R10.2
N$22
  Top 0.203: D11.A 12.48,40.26 R11.2
N$24
  Top 0.203: D12.A 23.91,41.91 R12.2
PUSH  (via drill 0.51)
  Top 0.203: U1.32 17.4,26.16 v14.38,26.16 | R15.2 24.5,13.55 S1.3 23.27,11.94 23.27,11.68 23.27,10.67 v22.51,9.91
  Bottom 0.203: v14.38,26.16 13.37,26.16 11.33,24.13 11.33,16 17.43,9.91 v22.51,9.91
RST  (via drill 0.51)
  Top 0.203: U1.29 20.08,26.56 19.46,27.18 v15.4,27.18
  Bottom 0.203: TP11.P$1 5.75,26.67 7.27,28.19 | 7.27,28.19 14.38,28.19 v15.4,27.18 | R16.1 7.27,30.82 7.27,28.19
SCK  (via drill 0.51)
  Top 0.203: U1.17 25.82,18.79 | 25.82,18.79 v26.57,18.03 | 25.82,18.79 27.34,18.79 27.59,18.54 27.59,15.82 R4.1
  Bottom 0.203: TP9.P$1 6.76,22.86 6.76,17.53 16.41,7.87 24.54,7.87 25.56,8.89 25.56,17.02 v26.57,18.03
SCL
  Top 0.203: U1.28 20.88,29.61 22.38,31.11 U2.6 27.88,31.11 R13.1
SDA
  Top 0.203: U1.27 21.68,28.45 U2.5 27.88,29.84 R14.1
VCC  (via drill 0.51)
  Top 0.203: R13.2 R14.2 | U1.4 19.57,21.99 20.48,21.08 | 20.48,21.08 20.48,20.07 | 20.48,20.07 19.46,19.05 18.45,19.05 17.11,20.39 U1.6 13.69,20.39 v13.37,20.07 13.37,21.08 12.35,22.1 v9.3,22.1 | 20.48,21.08 24.66,21.08 | 24.66,21.08 U1.20 | U1.18 20.95,19.59 20.48,20.07 | U2.8 25.94,33.65 v27.59,35.31 28.61,35.31 30.22,33.69 R13.2 | R13.2 31.65,30.31 v31.65,30.23 | v27.54,21.03 27.49,21.08 24.66,21.08 | S1.1 21.88,8.51 20.48,9.91 v20.48,12.95
  Bottom 0.203: R16.2 13.45,35.31 BT1.POSITIVE@4 BT1.POSITIVE@3 v27.59,35.31 | BT1.POSITIVE@1 v20.48,12.95 BT1.POSITIVE@2 13.37,18.54 v13.37,20.07 | 32.67,21.08 27.59,21.08 v27.54,21.03 | C3.1 32.67,19.9 32.67,21.08 | TP8.P$1 8.79,21.59 v9.3,22.1 | 32.67,21.08 33.69,22.1 33.69,28.19 v31.65,30.23

### Text on the board
tPlace: 12 | 11 | 1 | 10 | 2 | 9 | 3 | BORA / WATCH | 8 | 4 | 7 | 5
bPlace: AHERRERO